# Altium schematic sheet Main.SchDoc
size A4
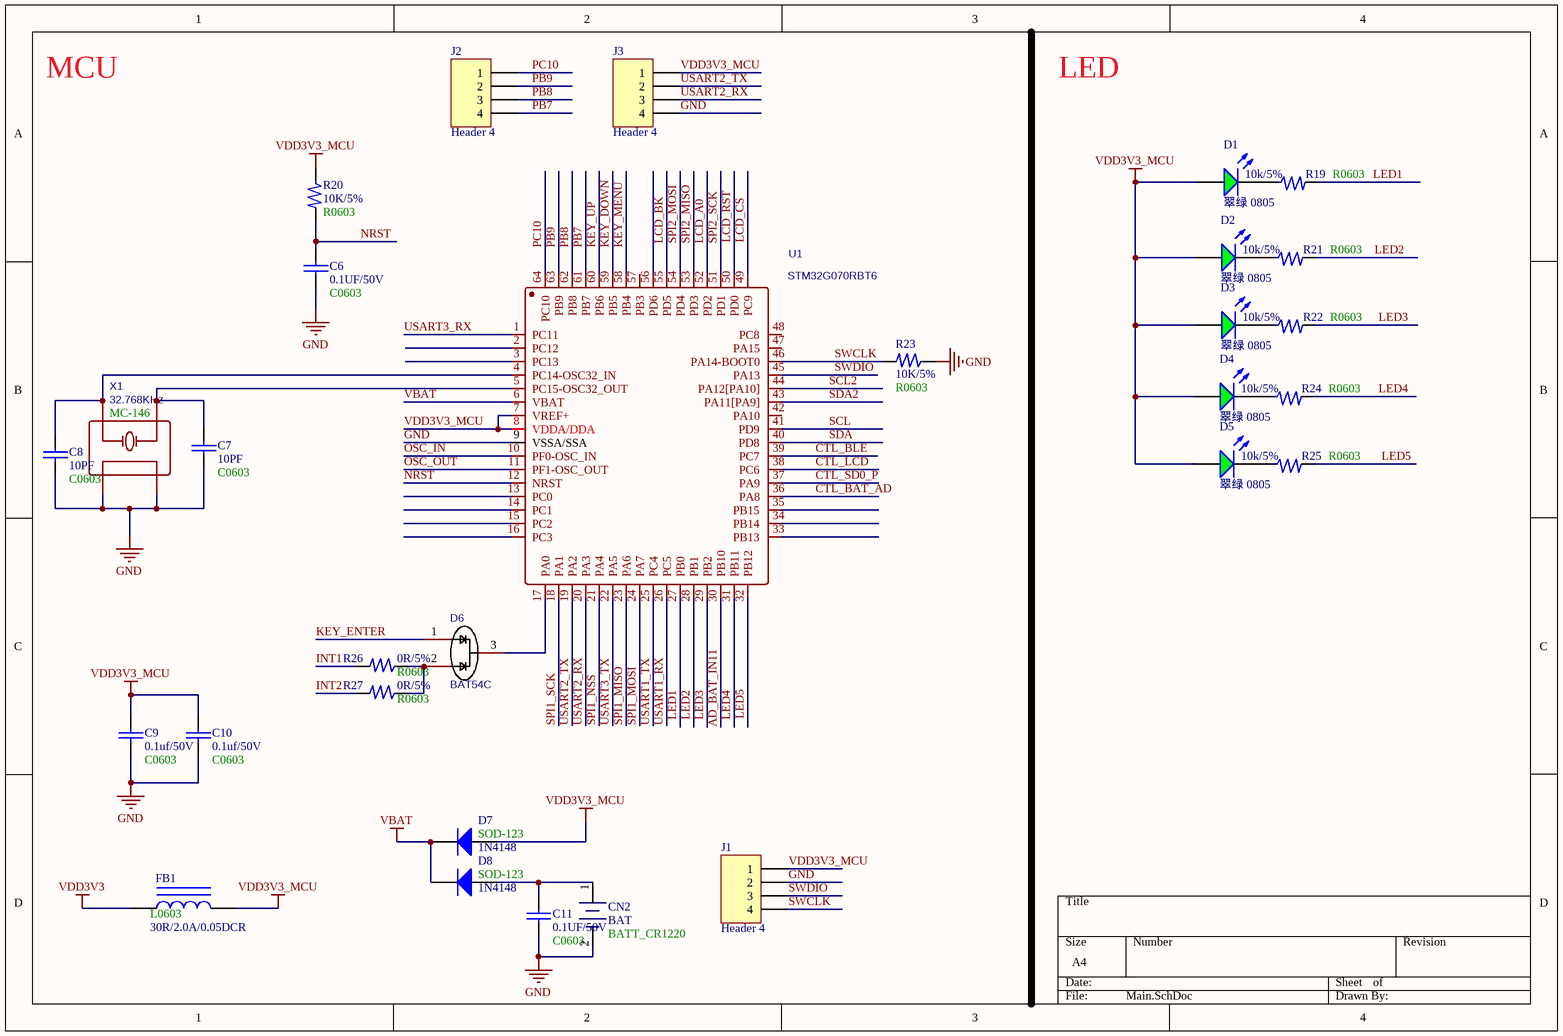
[diagram p0: Main.SchDoc]

## Parts
C6  0.1UF/50V  Footprint: C0603  [0603_C]
C7  10PF  Footprint: C0603  [0603_C]
C8  10PF  Footprint: C0603  [0603_C]
C9  0.1uf/50V  Footprint: C0603  [0603_C]
C10  0.1uf/50V  Footprint: C0603  [0603_C]
C11  0.1UF/50V  Footprint: C0603  [0603_C]
CN2  BAT  Footprint: BATT_CR1220  [BATS]
D1  翠绿 0805  [0805_LED_S1]
D2  翠绿 0805  [0805_LED_S1]
D3  翠绿 0805  [0805_LED_S1]
D4  翠绿 0805  [0805_LED_S1]
D5  翠绿 0805  [0805_LED_S1]
D6  BAT54C  [SOT-23(SOT-23-3)]
D7  1N4148  [SOD-123]
D8  1N4148  [SOD-123]
FB1  30R/2.0A/0.05DCR  Package: L0603  [0603_L]
J1  Header 4  [CON4-2.0]
J2  Header 4  [HDR1X4]
J3  Header 4  [HDR1X4]
R19  10k/5%  Footprint: R0603  [0603_R]
R20  10K/5%  Footprint: R0603  [0603_R]
R21  10k/5%  Footprint: R0603  [0603_R]
R22  10k/5%  Footprint: R0603  [0603_R]
R23  10K/5%  Footprint: R0603  [0603_R]
R24  10k/5%  Footprint: R0603  [0603_R]
R25  10k/5%  Footprint: R0603  [0603_R]
R26  0R/5%  Footprint: R0603  [0603_R]
R27  0R/5%  Footprint: R0603  [0603_R]
U1  STM32G070RBT6  [LQFP-64_L10.0-W10.0-P0.50-LS12.0-BL]
X1  32.768KHz  [MC-146_4P]

## Nets
GND: C6.1 C7.2 C8.2 C9.2 C10.2 C11.1 CN2.2 J1.2 J3.4 R23.2 U1.9(VSSA/SSA) X1.2 X1.3
VBAT: D7.2(K) D8.2(K) U1.6(VBAT)
VDD3V3: FB1.1
VDD3V3_MCU: C9.1 C10.1 D1.A D2.A D3.A D4.A D5.A D7.1(A) FB1.2 J1.1 J3.1 R20.2 U1.7(VREF+) U1.8(VDDA/DDA)
AD_BAT_IN11: U1.30(PB10)
CTL_BAT_AD: U1.36(PA8)
CTL_BLE: U1.39(PC7)
CTL_LCD: U1.38(PC6)
CTL_SD0_P: U1.37(PA9)
INT1: R26.1
INT2: R27.1
KEY_DOWN: U1.59(PB5)
KEY_ENTER: D6.1
KEY_MENU: U1.58(PB4)
KEY_UP: U1.60(PB6)
LCD_A0: U1.52(PD2)
LCD_BK: U1.55(PD5)
LCD_CS: U1.49(PC9)
LCD_RST: U1.50(PD0)
LED1: R19.1 U1.27(PB0)
LED2: R21.1 U1.28(PB1)
LED3: R22.1 U1.29(PB2)
LED4: R24.1 U1.31(PB11)
LED5: R25.1 U1.32(PB12)
NRST: C6.2 R20.1 U1.12(NRST)
OSC_IN: U1.10(PF0-OSC_IN)
OSC_OUT: U1.11(PF1-OSC_OUT)
PB7: J2.4 U1.61(PB7)
PB8: J2.3 U1.62(PB8)
PB9: J2.2 U1.63(PB9)
PC10: J2.1 U1.64(PC10)
SCL: U1.41(PD9)
SCL2: U1.44(PA12[PA10])
SDA: U1.40(PD8)
SDA2: U1.43(PA11[PA9])
SPI1_MISO: U1.23(PA6)
SPI1_MOSI: U1.24(PA7)
SPI1_NSS: U1.21(PA4)
SPI1_SCK: U1.18(PA1)
SPI2_MISO: U1.53(PD3)
SPI2_MOSI: U1.54(PD4)
SPI2_SCK: U1.51(PD1)
SWCLK: J1.4 R23.1 U1.46(PA14-BOOT0)
SWDIO: J1.3 U1.45(PA13)
USART1_RX: U1.26(PC5)
USART1_TX: U1.25(PC4)
USART2_RX: J3.3 U1.20(PA3)
USART2_TX: J3.2 U1.19(PA2)
USART3_RX: U1.1(PC11)
USART3_TX: U1.22(PA5)
NetC7_1: C7.1 U1.5(PC15-OSC32_OUT) X1.4(OSC2)
NetC8_1: C8.1 U1.4(PC14-OSC32_IN) X1.1(OSC1)
NetC11_2: C11.2 CN2.1 D8.1(A)
NetD1_K: D1.K R19.2
NetD2_K: D2.K R21.2
NetD3_K: D3.K R22.2
NetD4_K: D4.K R24.2
NetD5_K: D5.K R25.2
NetD6_2: D6.2 R26.2 R27.2
NetD6_3: D6.3 U1.17(PA0)

Not connected (* = marked no-connect by the designer): U1 2(PC12) 3(PC13) 13(PC0) 14(PC1) 15(PC2) 16(PC3) 33(PB13) 34(PB14) 35(PB15) 42(PA10) 47(PA15) 48(PC8) 56(PD6) 57(PB3)

## Notes on the sheet
- MCU
- LED
- (in symbol 32.768KHz) MC-146

## Library data of the parts
C6-C11 = CAP: Capacitor
D1-D5 = 0805 翠绿: 发光二极管; ComponentLink1Description: 供应商链接; ComponentLink1URL: http://www.szlcsc.com/product/details_2670.html; Package: 0805; Supplier: LC; SuppliersPartNumber: C2297
D6 = BAT54CW: Manufacturer: CJ（江苏长电/长晶）; Add into BOM: yes; Reverse Voltage (Vr): 30V; Average Rectified Current (Io): 200mA; Forward Voltage (Vf@If): 1V@100mA; Name: BAT54CW; Symbol: BAT54CW; Device: BAT54CW; LCSC Part Name: 30V 200mA 1V@100mA; Supplier Part: C77321; Manufacturer Part: BAT54CW; Supplier Footprint: SOT-323(SC-70); JLCPCB Part Class: Extended Part; Datasheet: https://atta.szlcsc.com/upload/public/pdf/source/20160702/1467448302669.pdf; Supplier: LCSC; Convert to PCB: yes
D7 D8 = SOD-123 B5819W  SL: 肖特基二极管; ComponentLink1Description: 供应商链接; ComponentLink1URL: http://www.szlcsc.com/product/details_9093.html; Package: SOD-123; Supplier: LC; SuppliersPartNumber: C8598
FB1 = 0603 3.9nH 0.3nH: 贴片电感; ComponentLink1Description: 供应商链接; ComponentLink1URL: http://www.szlcsc.com/product/details_14473.html; Supplier: LC; SuppliersPartNumber: C13818
J1-J3 = Header 4: Header, 4-Pin; LatestRevisionDate: 17-Jul-2002; LatestRevisionNote: Re-released for DXP Platform.; Publisher: Altium Limited
R19-R27 = 电阻
U1 = STM32G070RBT6: BOM_Manufacturer: STMicroelectronics; Contributor: LCSC; BOM_Supplier: LCSC; BOM_Supplier Part: C529340; BOM_Manufacturer Part: STM32G070RBT6; BOM_JLCPCB Part Class: Extended Part; spicePre: U; spiceSymbolName: STM32G070RBT6
X1 = 32.768KHz: BOM_Manufacturer: EPSON; BOM_Manufacturer Part: MC-14632.768kHz7.0pF20PPM; nameAlias: Frequency; Contributor: LCSC; SMT Type: Extend; BOM_Supplier: LCSC; BOM_Supplier Part: C94977; BOM_JLCPCB SMD: Yes; spicePre: X; spiceSymbolName: MC-14632.768kHz7.0pF20PPM